# Altium project STM32H743VGT6.PrjPcb
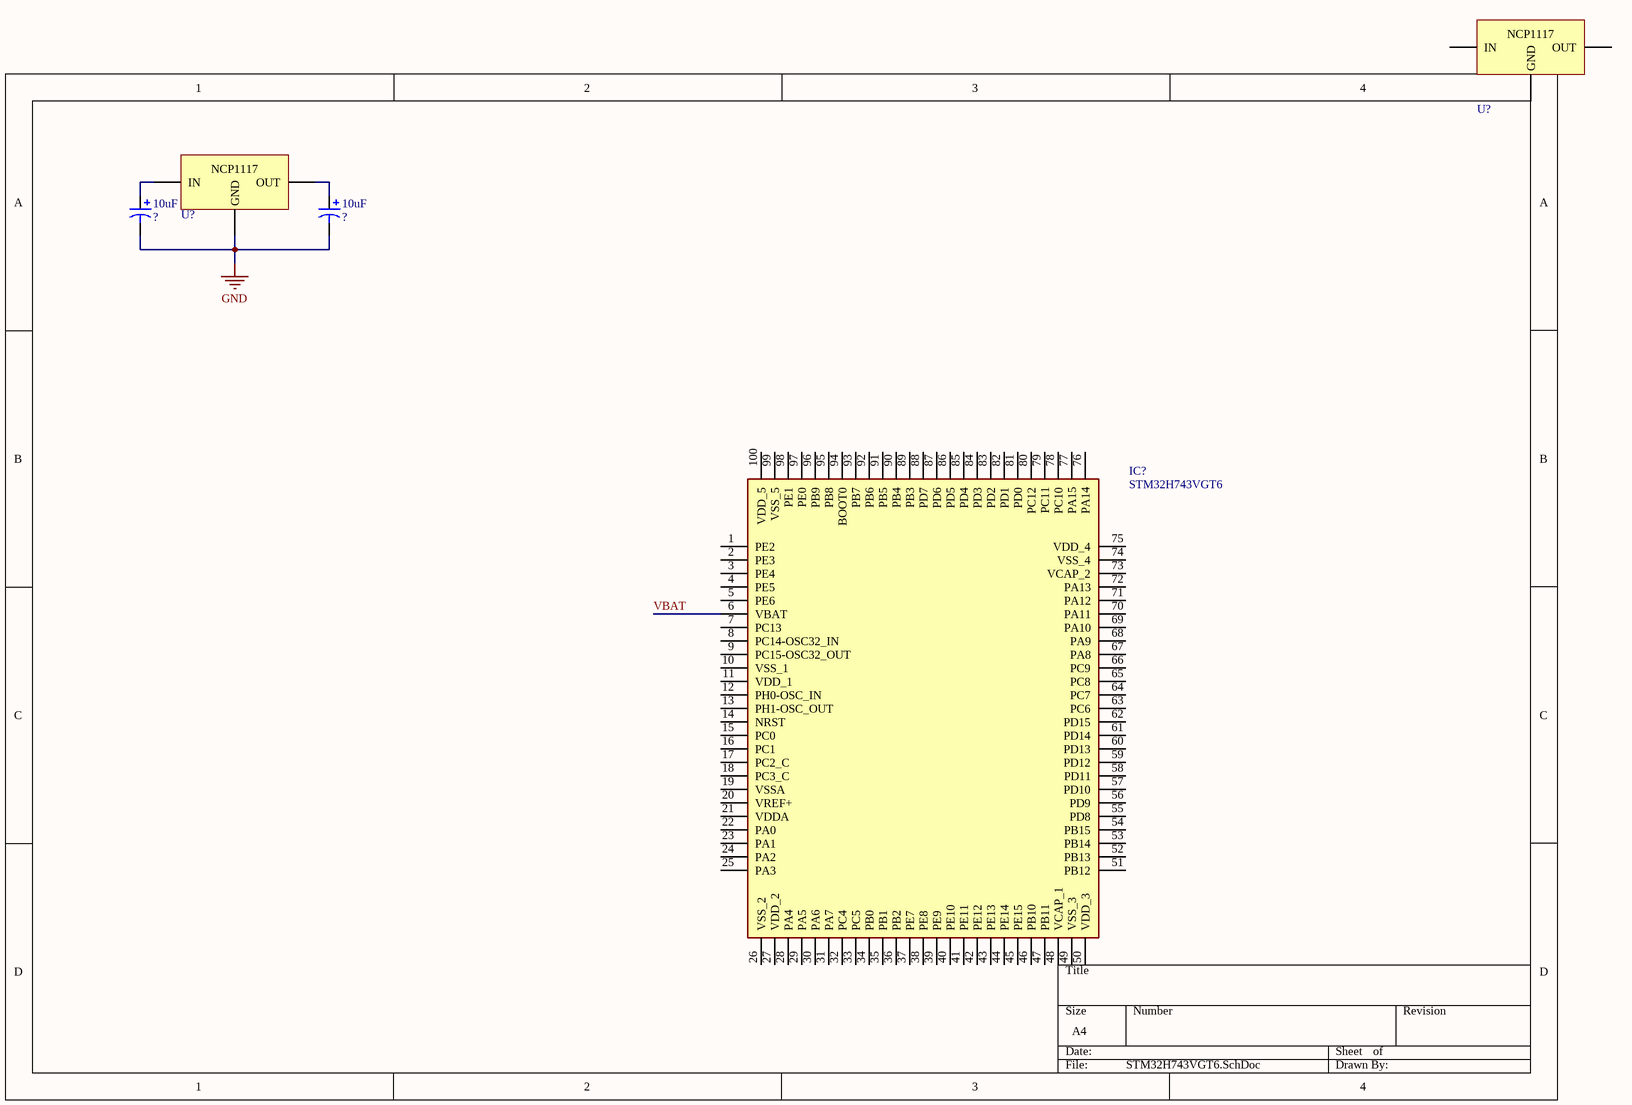
[diagram p0: STM32H743VGT6.SchDoc]
1 sheet, 5 parts. Net scope: global (net labels, ports and power ports of the same name join across sheets).

## Sheet STM32H743VGT6.SchDoc
size A4; SheetNumber: 1; SheetTotal: 1

### Parts
(Parts that share a designator on the sheet are numbered #1, #2 ... from top to bottom, then left to right.)
10uF#1  Capacitor_Pol  [PANASONIC_B_BO]  (value not drawn)
10uF#2  Capacitor_Pol  [PANASONIC_B_BO]  (value not drawn)
IC?  STM32H743VGT6  [QFP50P1600X1600X160-100N]
U?#1  NCP1117ST50T3G  [SOT223]  (value not drawn)
U?#2  NCP1117ST50T3G  [SOT223]  (value not drawn)

### Nets
GND: 10uF#1.2 10uF#2.2 U?#2.1(GND)
VBAT: IC?.6(VBAT)
Net10uF#1_1: 10uF#1.1 U?#2.3(IN)
Net10uF#2_1: 10uF#2.1 U?#2.2(OUT)

Not connected (* = marked no-connect by the designer): IC? 1(PE2) 2(PE3) 3(PE4) 4(PE5) 5(PE6) 7(PC13) 8(PC14-OSC32_IN) 9(PC15-OSC32_OUT) 10(VSS_1) 11(VDD_1) 12(PH0-OSC_IN) 13(PH1-OSC_OUT) 14(NRST) 15(PC0) 16(PC1) 17(PC2_C) 18(PC3_C) 19(VSSA) 20(VREF+) 21(VDDA) 22(PA0) 23(PA1) 24(PA2) 25(PA3) 26(VSS_2) 27(VDD_2) 28(PA4) 29(PA5) 30(PA6) 31(PA7) 32(PC4) 33(PC5) 34(PB0) 35(PB1) 36(PB2) 37(PE7) 38(PE8) 39(PE9) 40(PE10) 41(PE11) 42(PE12) 43(PE13) 44(PE14) 45(PE15) 46(PB10) 47(PB11) 48(VCAP_1) 49(VSS_3) 50(VDD_3) 51(PB12) 52(PB13) 53(PB14) 54(PB15) 55(PD8) 56(PD9) 57(PD10) 58(PD11) 59(PD12) 60(PD13) 61(PD14) 62(PD15) 63(PC6) 64(PC7) 65(PC8) 66(PC9) 67(PA8) 68(PA9) 69(PA10) 70(PA11) 71(PA12) 72(PA13) 73(VCAP_2) 74(VSS_4) 75(VDD_4) 76(PA14) 77(PA15) 78(PC10) 79(PC11) 80(PC12) 81(PD0) 82(PD1) 83(PD2) 84(PD3) 85(PD4) 86(PD5) 87(PD6) 88(PD7) 89(PB3) 90(PB4) 91(PB5) 92(PB6) 93(PB7) 94(BOOT0) 95(PB8) 96(PB9) 97(PE0) 98(PE1) 99(VSS_5) 100(VDD_5); U?#1 1(GND) 2(OUT) 3(IN)

### Notes on the sheet
- (in symbol NCP1117ST50T3G) NCP1117

### Library data of the parts
IC? = STM32H743VGT6: Integrated Circuit; Manufacturer_Name: STMicroelectronics; Datasheet Link: https://componentsearchengine.com/Datasheets/1/STM32H743VGT6.pdf; Height: 1.6mm; Manufacturer_Part_Number: STM32H743VGT6; Mouser Part Number: 511-STM32H743VGT6; Mouser Price/Stock: https://www.mouser.co.uk/ProductDetail/STMicroelectronics/STM32H743VGT6?qs=%252B6g0mu59x7JjCCaXtUod8g%3D%3D; Arrow Part Number: STM32H743VGT6; Arrow Price/Stock: https://www.arrow.com/en/products/stm32h743vgt6/stmicroelectronics?region=nac
U?#1 U?#2 = NCP1117ST50T3G: 1.0 A Low-Dropout Positive / Fixed and Adjustable / Voltage Regulators; Output voltage: 5V; Dropout voltage: 1.2V; Max output current: 1 A
10uF#1 10uF#2 = Capacitor_Pol: Value: ?